# EAGLE design Bpod_Serial_Shield_r3 (EAGLE 7.6.0)
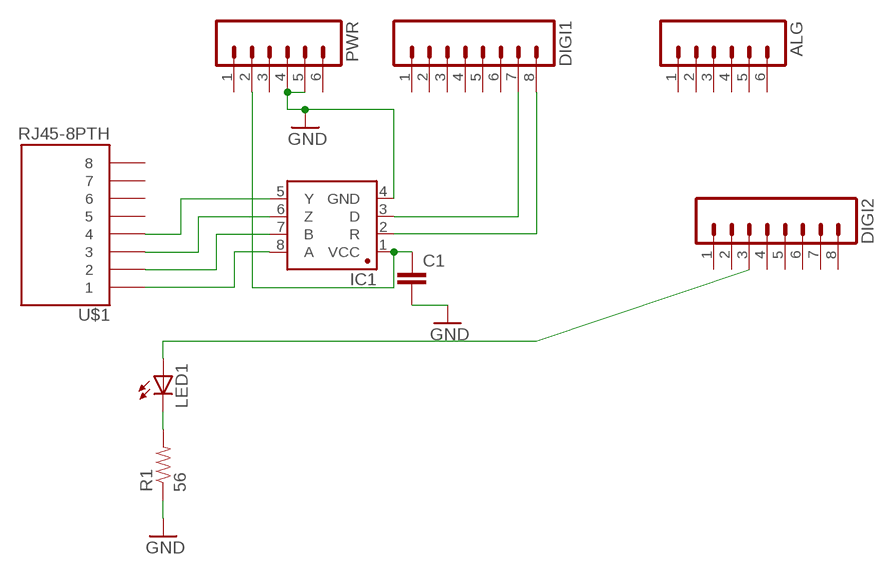
[diagram p0: schematic, sheet 1]

## Parts
ALG  M06LONGPADS  [1X06_LONGPADS]
C1  CAP1206  [1206]
DIGI1  M08LONGPADS  [1X08_LONGPADS]
DIGI2  M08LONGPADS  [1X08_LONGPADS]
IC1  SN65HVD31DR  [SO08]
LED1  LEDCHIPLED_1206  [CHIPLED_1206]
PWR  M06LONGPADS  [1X06_LONGPADS]
R1  56  RESISTOR1206  [1206]
U$1  RJ45-8PTH  [RJ45-8]

## Nets
GND: C1.2 IC1.4(GND) PWR.4 PWR.5 R1.1
N$1: C1.1 IC1.1(VCC) PWR.2
N$2: LED1.C R1.2
N$3: DIGI2.3 LED1.A
N$4: DIGI1.7 IC1.3(D)
N$6: DIGI1.8 IC1.2(R)
N$7: IC1.8(A) U$1.1
N$8: IC1.7(B) U$1.2
N$9: IC1.6(Z) U$1.3
N$10: IC1.5(Y) U$1.4
Unconnected: ALG.1 ALG.2 ALG.3 ALG.4 ALG.5 ALG.6 DIGI1.1 DIGI1.2 DIGI1.3 DIGI1.4 DIGI1.5 DIGI1.6 DIGI2.1 DIGI2.2 DIGI2.4 DIGI2.5 DIGI2.6 DIGI2.7 DIGI2.8 PWR.1 PWR.3 PWR.6 U$1.5 U$1.6 U$1.7 U$1.8

## Library data of the parts
ALG PWR = SparkFun:M06: Header 6 Standard 6-pin 0.1" header. Use with straight break away headers (SKU : PRT-00116), right angle break away headers (PRT-00553), swiss pins (PRT-00743), machine pins (PRT-00117), and female headers (PRT-00115). Molex polarized connector foot print use with SKU : PRT-08094 with associated crimp pins and housings. NOTES ON THE VARIANTS LOCK and LOCK_LONGPADS... This footprint was designed to help hold the alignment of a through-hole component (i.e. 6-pin header) while soldering it into place. You may notice that each hole has been shifted either up or down by 0.005 of an inch from it's more standard position (which is a perfectly straight line). This slight alteration caused the pins (the squares in the middle) to touch the edges of the holes. Because they are alternating, it causes a "brace" to hold the component in place. 0.005 has proven to be the perfect amount of "off-center" position when using our standard breakaway headers. Although looks a little odd when you look at the bare footprint, once you have a header in there, the alteration is very hard to notice. Also, if you push a header all the way into place, it is covered up entirely on the bottom side. This idea of altering the position of holes to aid alignment will be further integrated into the Sparkfun Library for other footprints. It can help hold any component with 3 or more connection pins.
C1 = SparkFun-Capacitors:CAP: Capacitor Standard 0603 ceramic capacitor, and 0.1" leaded capacitor.
DIGI1 DIGI2 = SparkFun:M08: Header 8 Standard 8-pin 0.1" header. Use with straight break away headers (SKU : PRT-00116), right angle break away headers (PRT-00553), swiss pins (PRT-00743), machine pins (PRT-00117), and female headers (PRT-00115).
IC1 = Joshparts4:SN65HVD31DR: A placeholder for generic narrow & wide SOIC8 foorptints - used on the DIP adapter board.
LED1 = adafruit:LED: LED OSRAM: - CHIPLED LG R971, LG N971, LY N971, LG Q971, LY Q971, LO R971, LY R971 LH N974, LH R974 LS Q976, LO Q976, LY Q976 LO Q996 - Hyper CHIPLED LW Q18S LB Q993, LB Q99A, LB R99A - SideLED LS A670, LO A670, LY A670, LG A670, LP A670 LB A673, LV A673, LT A673, LW A673 LH A674 LY A675 LS A676, LA A676, LO A676, LY A676, LW A676 LS A679, LY A679, LG A679 - Hyper Micro SIDELED® LS Y876, LA Y876, LO Y876, LY Y876 LT Y87S - SmartLED LW L88C, LW L88S LB L89C, LB L89S, LG L890 LS L89K, LO L89K, LY L89K LS L896, LA L896, LO L896, LY L896 - TOPLED LS T670, LO T670, LY T670, LG T670, LP T670 LSG T670, LSP T670, LSY T670, LOP T670, LYG T670 LG T671, LOG T671, LSG T671 LB T673, LV T673, LT T673, LW T673 LH T674 LS T676, LA T676, LO T676, LY T676, LB T676, LH T676, LSB T676, LW T676 LB T67C, LV T67C, LT T67C, LS T67K, LO T67K, LY T67K, LW E67C LS E67B, LA E67B, LO E67B, LY E67B, LB E67C, LV E67C, LT E67C LW T67C LS T679, LY T679, LG T679 LS T770, LO T770, LY T770, LG T770, LP T770 LB T773, LV T773, LT T773, LW T773 LH T774 LS E675, LA E675, LY E675, LS T675 LS T776, LA T776, LO T776, LY T776, LB T776 LHGB T686 LT T68C, LB T68C - Hyper Mini TOPLED® LB M676 - Mini TOPLED Santana® LG M470 LS M47K, LO M47K, LY M47K Source: http://www.osram.convergy.de/
R1 = SparkFun-Resistors:RESISTOR: Resistor Basic schematic elements and footprints for 0603, 1206, and PTH resistors.
U$1 = SparkFun:RJ45-8: RJ45 Jack Simple RJ45, 8-pin connection - connector for common Cat5, Cat5e, and Cat6 Ethernet cables. Footprint not yet proven in production. Connector sku is PRT-00643; Breakout PCB sku is BOB-00716.

## Board
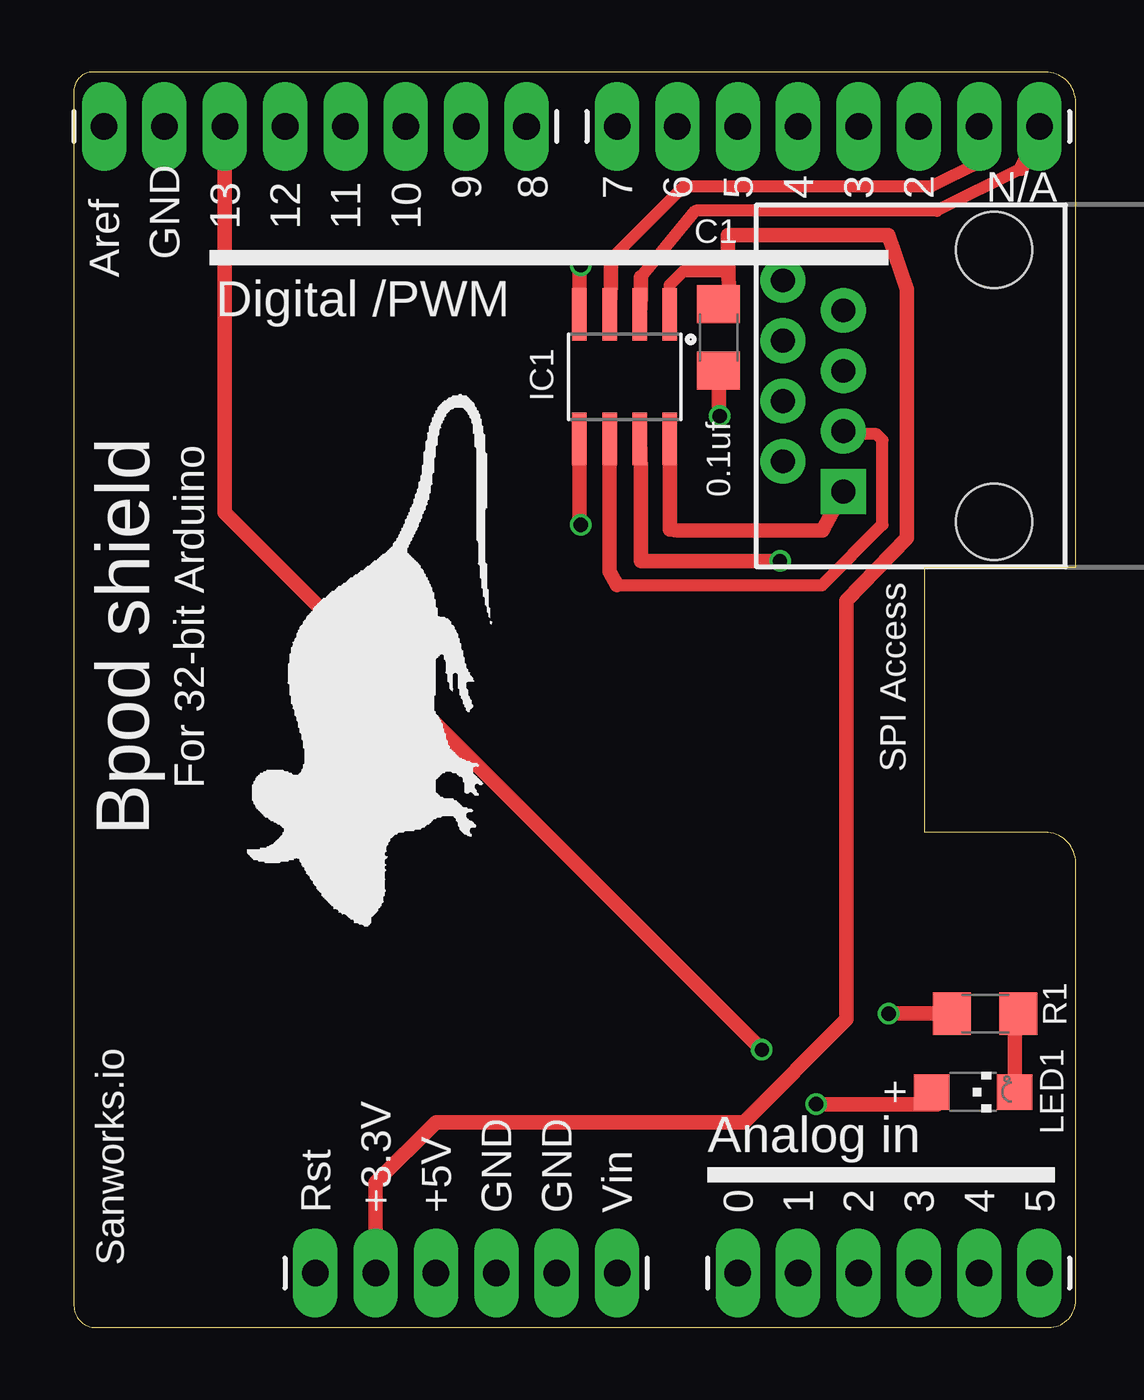
[diagram p1: board, top side]
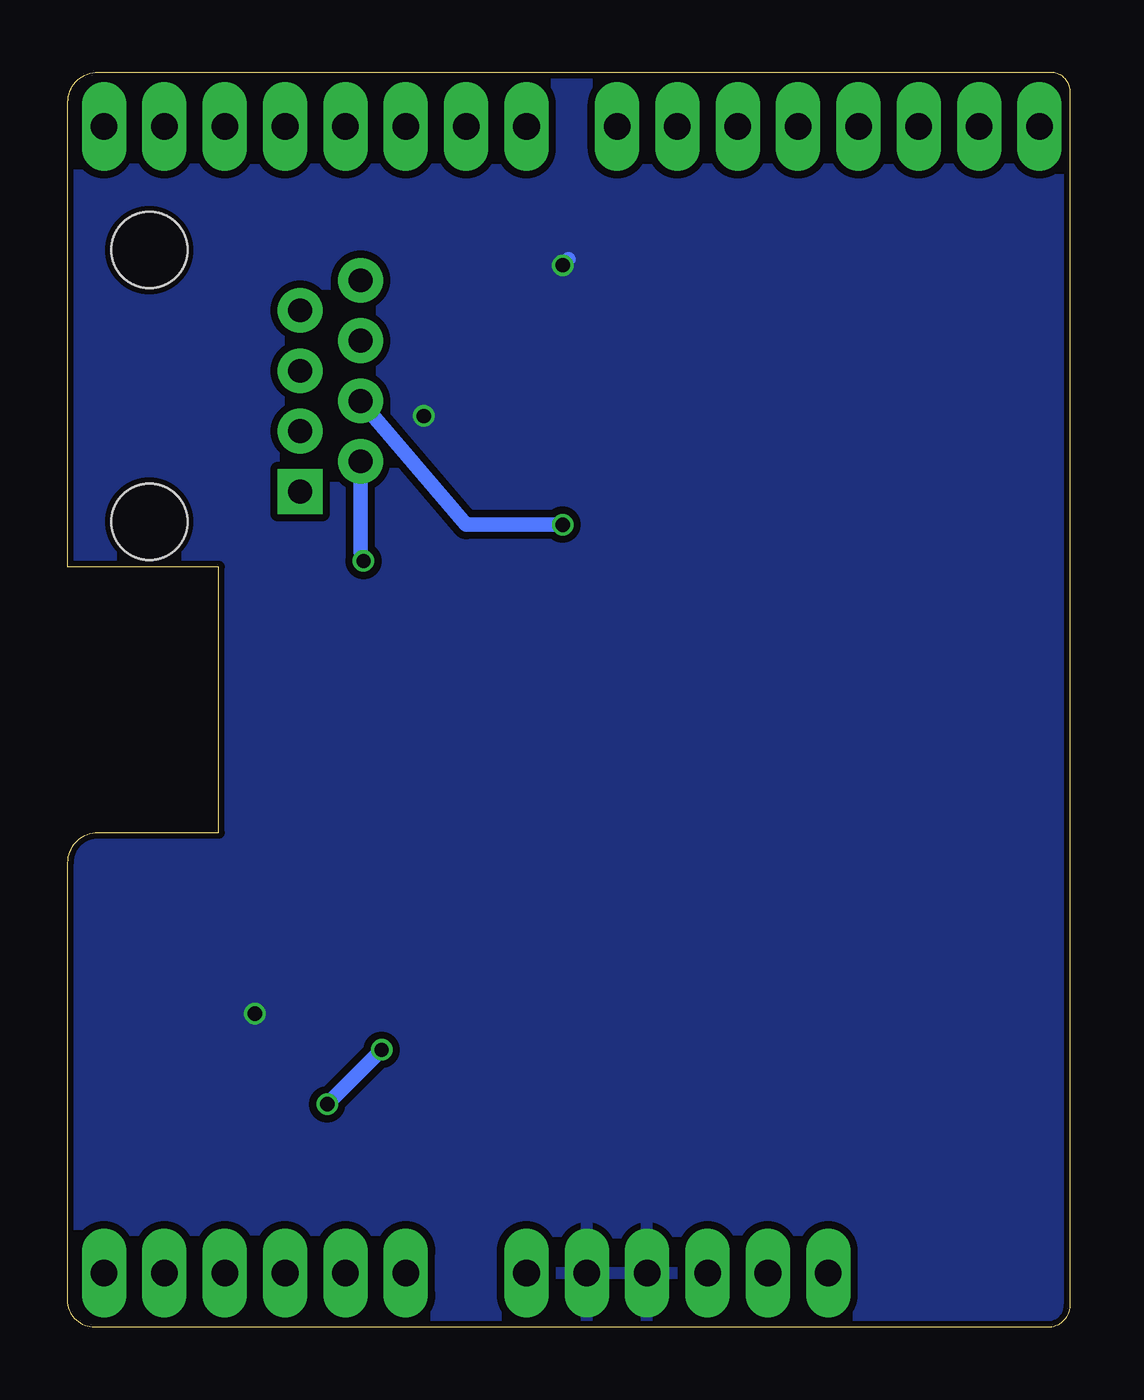
[diagram p2: board, bottom side, seen from below]

Size 42.16 x 52.83 mm. Coordinates in mm from the lower left corner, seen from the top.
Outline: 42.16,32 42.16,51.56 arc90 40.89,52.83 0.8,52.83 arc90 0,52.03 0,0.92 arc90 0.92,0 41.03,0 arc90 42.16,1.14 42.16,19.56 arc90 40.89,20.83 35.81,20.83 35.81,32 42.16,32
Copper layers (1*16): Top 0.035mm / dielectric 1.5mm / Bottom 0.035mm
Design rules "SeeedStudio_2layer_DRU_no_angle_20140221 *": minimum track width 6mil, minimum drill 12mil, track to track 12mil, track to pad 12mil, pad to pad 12mil, via to via 12mil, smd to smd 0mil, copper to edge 10mil, drill to drill 10mil, minimum pad ring 10mil, minimum via ring 6mil, stop-mask expansion 2mil, vias tented up to drill 100mil, thermal gap 10mil

### Footprints (pad centres in the part's own frame; a part is rotated, then mirrored left to right if it is on the bottom)
1X06_LONGPADS = drill 1.118 pad 1.88 long: 1 0,0; 2 2.54,0; 3 5.08,0; 4 7.62,0; 5 10.16,0; 6 12.7,0
1206 = smd 1.6 x 1.8: 1 -1.4,0; 2 1.4,0
1X08_LONGPADS = drill 1.118 pad 1.88 long: 1 0,0; 2 2.54,0; 3 5.08,0; 4 7.62,0; 5 10.16,0; 6 12.7,0; 7 15.24,0; 8 17.78,0
SO08 = smd 0.61 x 2.21: 1 -1.905,-2.616; 2 -0.635,-2.616; 3 0.635,-2.616; 4 1.905,-2.616; 5 1.905,2.616; 6 0.635,2.616; 7 -0.635,2.616; 8 -1.905,2.616
CHIPLED_1206 = smd 1.5 x 1.5: A 0,-1.75; C 0,1.75
RJ45-8 = drill 1 pad 1.88 square: 1 -4.445,6.35 | drill 1 pad 1.88: 2 -3.175,8.89; 3 -1.905,6.35; 4 -0.635,8.89; 5 0.635,6.35; 6 1.905,8.89; 7 3.175,6.35; 8 4.445,8.89 | hole 3.2: -5.715,0; 5.715,0

### Placement (x,y rotation side)
ALG  27.94,2.29 0 top
C1  27.13,41.66 270 top
DIGI1  22.86,50.55 0 top
DIGI2  1.27,50.55 0 top
IC1  23.18,40.01 180 top
LED1  37.85,9.91 270 top
PWR  10.16,2.29 0 top
R1  38.35,13.21 0 top
U$1  38.73,39.62 90 top
U$2  [MOUSELOGO]  5.43,14.96 0 top

### Tracks (layer width: path | path; a pad name or v marks a point on that pad's centre or on a via)
GND  (via drill 0.6)
  Top 0.6: C1.2 27.13,39.83 v27.18,38.35 | IC1.4 21.28,44.51 v21.34,44.7 | R1.1 v34.29,13.21
  Bottom 0.6: v21.34,44.7 21.08,44.96
  pour Bottom: 42.16,32 42.16,51.75 arc90 41.09,52.83 0.72,52.83 arc90 0,52.11 0,1.08 arc90 1.08,0 41.25,0 arc90 42.16,0.92 42.16,19.56 arc90 40.89,20.83 35.81,20.83 35.81,32
N$1
  Top 0.508: IC1.1 25.09,43.88 25.65,44.45 27.54,44.45 27.57,43.4
  Top 0.6: C1.1 27.43,43.61 27.43,42.67 27.57,43.4 27.53,45.97 34.29,45.97 35.05,43.69 35.05,33.23 32.51,30.59 32.51,12.95 28.19,8.64 15.24,8.64 12.7,6.1 PWR.2
N$2
  Top 0.6: LED1.C 39.6,13.11 R1.2
N$3  (via drill 0.6)
  Top 0.6: DIGI2.3 6.35,34.29 v28.96,11.68 | v31.24,9.4 36.35,9.4 LED1.A
  Bottom 0.6: v28.96,11.68 v31.24,9.4
N$4
  Top 0.508: 38.1,49.02 36.07,48.01 25.65,48.01 22.61,44.96
  Top 0.6: DIGI1.7 38.1,49.02 | 22.61,44.96 22.61,43.9 IC1.3
N$6
  Top 0.508: 39.88,48.77 36.32,46.99 26.16,46.99 23.88,44.2
  Top 0.6: DIGI1.8 40.64,50.29 39.88,48.77 | 23.88,44.2 23.88,43.4 IC1.2
N$7
  Top 0.6: U$1.1 31.5,33.53 25.4,33.53 25.09,33.59 IC1.8
N$8  (via drill 0.6)
  Top 0.6: IC1.7 23.88,36.12 23.88,32.26 v29.72,32.26
  Bottom 0.6: v29.72,32.26 29.84,32.64 U$1.2
N$9
  Top 0.508: 22.86,31.24 31.5,31.24 34.04,33.78 34.04,37.34 33.78,37.59 32.51,37.59 U$1.3
  Top 0.6: 22.86,31.24 22.55,31.81 IC1.6
N$10  (via drill 0.6)
  Top 0.6: IC1.5 21.28,33.78 v21.34,33.78
  Bottom 0.6: v21.34,33.78 25.4,33.78 U$1.4

### Text on the board
tPlace: N/A | 9 | 8 | 7 | 6 | 5 | 4 | 3 | 2 | 13 | 12 | 11 | 10 | GND | Aref | Digital /PWM | 0.1uf | SPI Access | For 32-bit Arduino | Bpod shield | Sanworks.io | + | Analog in | Rst | +3.3V | +5V | GND | GND | Vin | 0 | 1 | 2 | 3 | 4 | 5